# Altium schematic sheet peripheral_UART.SchDoc: UART Module
size A3; Author: mayerph; DrawnBy: mayerph; Organization: IIS; Revision: PA; SheetNumber: 3; SheetTotal: 3
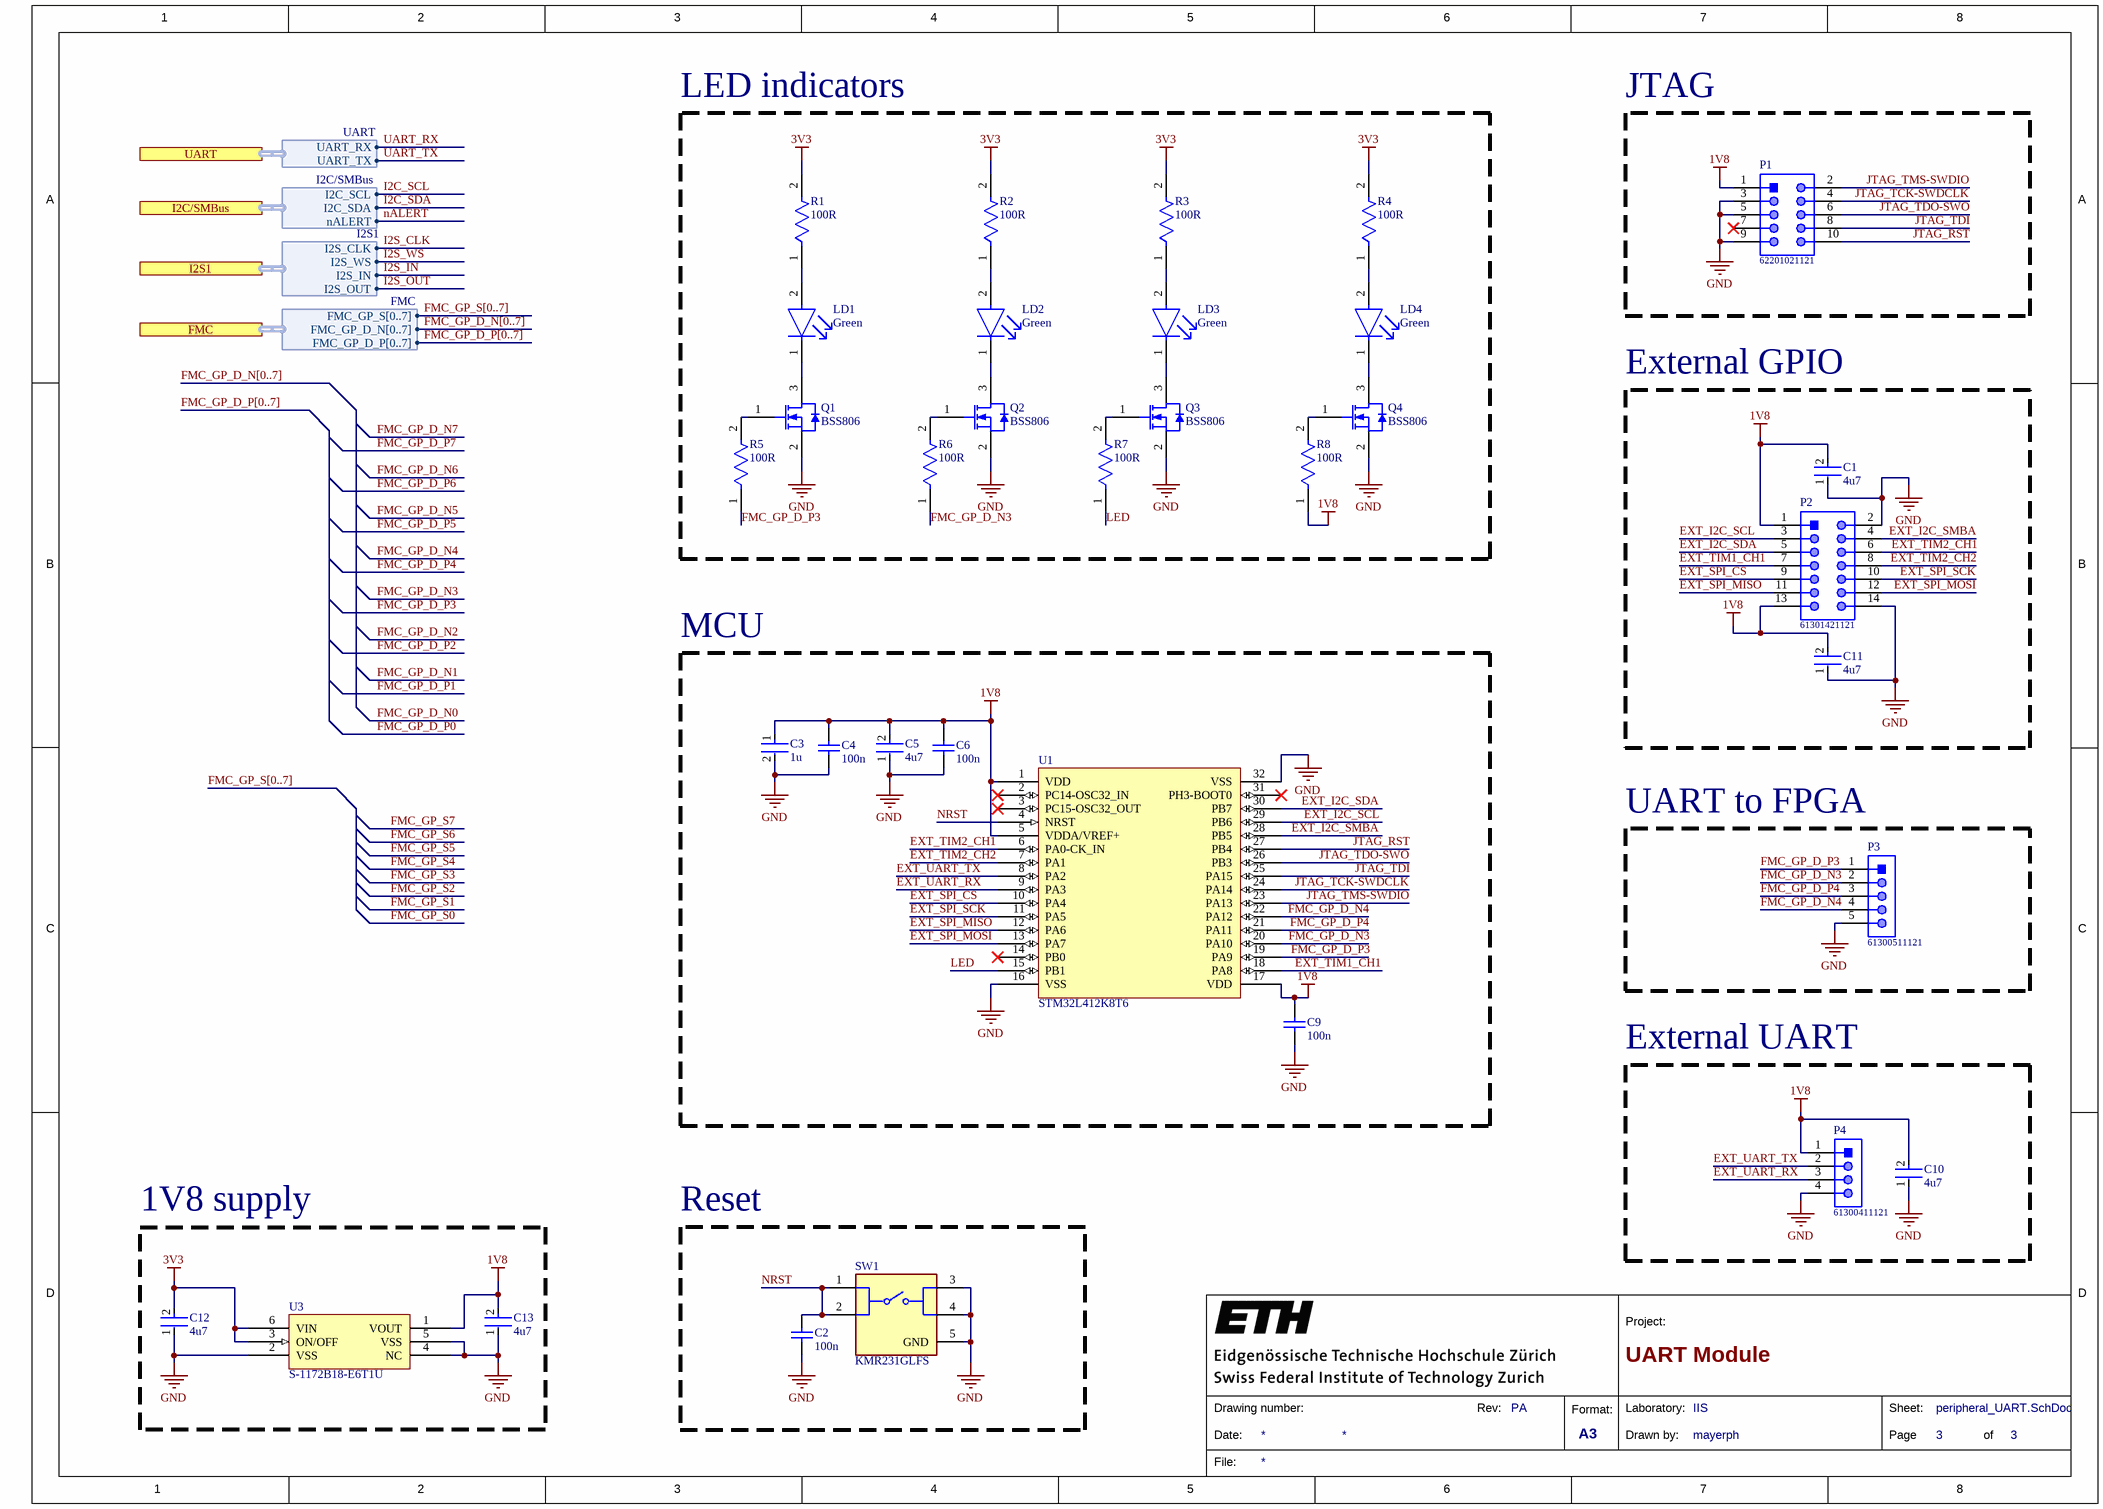
[diagram p0: peripheral_UART.SchDoc]

## Parts
C1  4u7  [FP-C1608-080-0_1-IPC_C]
C2  100n  [CAPC1608X90X35ML15T15]
C3  1u  [FP-CL10B105KO8NNNC-MFG]
C4  100n  [CAPC1608X90X35ML15T15]
C5  4u7  [FP-C1608-080-0_1-IPC_C]
C6  100n  [CAPC1608X90X35ML15T15]
C9  100n  [CAPC1608X90X35ML15T15]
C10  4u7  [FP-C1608-080-0_1-IPC_C]
C11  4u7  [FP-C1608-080-0_1-IPC_C]
C12  4u7  [FP-C1608-080-0_1-IPC_C]
C13  4u7  [FP-C1608-080-0_1-IPC_C]
LD1  Green  [FP-150060VS75000-MFG]
LD2  Green  [FP-150060VS75000-MFG]
LD3  Green  [FP-150060VS75000-MFG]
LD4  Green  [FP-150060VS75000-MFG]
P1  62201021121  [62201021121]
P2  61301421121  [61301421121]
P3  61300511121  [61300511121]
P4  61300411121  [61300411121]
Q1  BSS806  [FAIR-SSOT3L-3_V]
Q2  BSS806  [FAIR-SSOT3L-3_V]
Q3  BSS806  [FAIR-SSOT3L-3_V]
Q4  BSS806  [FAIR-SSOT3L-3_V]
R1  100R  [FP-CRCW0603-e3-IPC_B]
R2  100R  [FP-CRCW0603-e3-IPC_B]
R3  100R  [FP-CRCW0603-e3-IPC_B]
R4  100R  [FP-CRCW0603-e3-IPC_B]
R5  100R  [FP-CRCW0603-e3-IPC_B]
R6  100R  [FP-CRCW0603-e3-IPC_B]
R7  100R  [FP-CRCW0603-e3-IPC_B]
R8  100R  [FP-CRCW0603-e3-IPC_B]
SW1  KMR231GLFS  [FP-KMR231GLFS-MFG]
U1  STM32L412K8T6  [STM32L412K8T6]
U3  S-1172B18-E6T1U  [S1172]

## Blocks framed on the sheet
LED indicators: LD1-LD4 Q1-Q4 R1-R8
JTAG: P1
External GPIO: C1 C11 P2
MCU: C3-C6 C9 U1
UART to FPGA: P3
External UART: C10 P4
1V8 supply: C12 C13 U3
Reset: C2 SW1

## Ports
FMC (harness FMC), I2C/SMBus (harness I2C/SMBus), I2S1 (harness I2S1), UART (harness UART)

## Harnesses
I2C/SMBus: I2C_SDA, I2C_SCL, nALERT
UART: UART_TX, UART_RX
I2S1: I2S_OUT, I2S_IN, I2S_WS, I2S_CLK
FMC: FMC_GP_D_N[0..7], FMC_GP_S[0..7], FMC_GP_D_P[0..7]

## Nets
1V8: C1.2 C3.1 C4.2 C5.2 C6.2 C9.2 C10.2 C11.2 C13.2 P1.1 P2.1 P2.13 P4.1 R8.1 U1.1(VDD) U1.5(VDDA/VREF+) U1.17(VDD) U3.1(VOUT)
3V3: C12.2 R1.2 R2.2 R3.2 R4.2 U3.3(ON/OFF) U3.6(VIN)
GND: C1.1 C2.1 C3.2 C4.1 C5.1 C6.1 C9.1 C10.1 C11.1 C12.1 C13.1 P1.3 P1.5 P1.9 P2.2 P2.14 P3.5 P4.4 Q1.2(S) Q2.2(S) Q3.2(S) Q4.2(S) SW1.3 SW1.4 SW1.5(GND) U1.16(VSS) U1.32(VSS) U3.2(VSS) U3.4(NC) U3.5(VSS)
EXT_I2C_SCL: P2.3 U1.29(PB6)
EXT_I2C_SDA: P2.5 U1.30(PB7)
EXT_I2C_SMBA: P2.4 U1.28(PB5)
EXT_SPI_CS: P2.9 U1.10(PA4)
EXT_SPI_MISO: P2.11 U1.12(PA6)
EXT_SPI_MOSI: P2.12 U1.13(PA7)
EXT_SPI_SCK: P2.10 U1.11(PA5)
EXT_TIM1_CH1: P2.7 U1.18(PA8)
EXT_TIM2_CH1: P2.6 U1.6(PA0-CK_IN)
EXT_TIM2_CH2: P2.8 U1.7(PA1)
EXT_UART_RX: P4.3 U1.9(PA3)
EXT_UART_TX: P4.2 U1.8(PA2)
FMC_GP_D_N3: P3.2 R6.1 U1.20(PA10)
FMC_GP_D_N4: P3.4 U1.22(PA12)
FMC_GP_D_P3: P3.1 R5.1 U1.19(PA9)
FMC_GP_D_P4: P3.3 U1.21(PA11)
I2C_SCL: port I2C/SMBus.I2C_SCL
I2C_SDA: port I2C/SMBus.I2C_SDA
I2S_CLK: port I2S1.I2S_CLK
I2S_IN: port I2S1.I2S_IN
I2S_OUT: port I2S1.I2S_OUT
I2S_WS: port I2S1.I2S_WS
JTAG_RST: P1.10 U1.27(PB4)
JTAG_TCK-SWDCLK: P1.4 U1.24(PA14)
JTAG_TDI: P1.8 U1.25(PA15)
JTAG_TDO-SWO: P1.6 U1.26(PB3)
JTAG_TMS-SWDIO: P1.2 U1.23(PA13)
LED: R7.1 U1.15(PB1)
nALERT: port I2C/SMBus.nALERT
NRST: C2.2 SW1.1 SW1.2 U1.4(NRST)
UART_RX: port UART.UART_RX
UART_TX: port UART.UART_TX
NetLD1_1: LD1.1(C) Q1.3(D)
NetLD1_2: LD1.2(A) R1.1
NetLD2_1: LD2.1(C) Q2.3(D)
NetLD2_2: LD2.2(A) R2.1
NetLD3_1: LD3.1(C) Q3.3(D)
NetLD3_2: LD3.2(A) R3.1
NetLD4_1: LD4.1(C) Q4.3(D)
NetLD4_2: LD4.2(A) R4.1
NetQ1_1: Q1.1(G) R5.2
NetQ2_1: Q2.1(G) R6.2
NetQ3_1: Q3.1(G) R7.2
NetQ4_1: Q4.1(G) R8.2

Not connected (* = marked no-connect by the designer): P1 7*; U1 2(PC14-OSC32_IN)* 3(PC15-OSC32_OUT)* 14(PB0)* 31(PH3-BOOT0)*

## Buses and harness runs
bus FMC_GP_D_N[0..7]
bus FMC_GP_D_P[0..7]
bus FMC_GP_S[0..7]

## Notes on the sheet
- 1
- 2
- 3
- 4
- 5
- 6
- 7
- 8
- A
- B
- C
- D
- Project:
- Date:
- Drawing number:
- Rev:
- Format:
- A3
- Drawn by:
- Laboratory:
- Page
- Sheet:
- of
- File:

## Library data of the parts
C1 C5 C10-C13 = CMP-2000-04981-2: Multilayer Ceramic Capacitors 4.7μF ±10% 16V X7R SMD 0603; Manufacturer: Murata Electronics; Dielectric: X5R; P\N: GRM188Z71C475KE21D; Tolerance: 10%; Thickness: 0.035inch; Length: 1.6mm; Width: 0.031inch; Height: 0.8mm; Package Quantity: 1; Voltage: 16V; Construction: Flat; Weight: 7.1E-05oz; Depth: 0.8mm; Case Code (Metric): 1608; Series: C; Lead Free: Lead Free; Voltage Rating: 16V; Voltage Rating (DC): 16V; Value: 4u7; Termination: SMD/SMT; REACH SVHC: No SVHC; RoHS Compliant: Yes; Case Code (Imperial): 0603; Case/Package: 0603; Mount: Surface Mount; Dielectric Material: Ceramic; Packaging: Tape and Reel; Min Operating Temperature: -55°C; Max Operating Temperature: 85°C; Supplier: Digi-Key; Supplier P/N: 490-GRM188Z71C475KE21DCT-ND
C2 C4 C6 C9 = CMP-2006-04496-1: Multilayer Ceramic Capacitors 100nF ±10% 16V X7R SMD 0603; Manufacturer: KEMET; Part Number: 0603YC104KAZ2A; P\N: C0603C104K4RAC7867; Value: 100n; Supplier: Digi-Key; Supplier P/N: 399-C0603C104K4RAC7867CT-ND
C3 = CMP-2000-06093-2: Multilayer Ceramic Capacitors 1μF ±10% 16V X7R SMD 0603; Manufacturer: KEMET; Manufacturer Part Number: CL10B105KO8NNNC; Capacitance: 1uF; Temperature Coefficient: 15%; P\N: C0603C105K4RAC7411; Voltage Rating: 16V; Automotive: No; ComponentLink2Description: Datasheet; Device Class L3: Ceramic Capacitors; Temperature Characteristic: X7R; Temperature Range High: +125°C; Digikey Description: CAP CER 1UF 16V X7R 0603; Device Class L2: Capacitors; Octopart: https://octopart.com/cl10b105ko8nnnc-samsung-19018973; ComponentLink2URL: http://www.samsungsem.com/global/front/downloadcms.do?path=%2F%2Fglobal%2F%2Fsupport%2F%2Fproduct-search%2F%2Fmlcc%2F%2F__icsFiles%2F%2Fafieldfile%2F%2F2019%2F%2F06%2F%2F18&fileName=CL10B105KO8NNNC-19.pdf; Lead Free: Yes; Height: 0.9mm; Package: CL10B105KO8NNNC; Temperature Range Low: -55°C; Value: 1u; Material: Ceramic; Device Class L1: Passive Components; RoHS: TRUE; Temperature: -55°C to +125°C; Category: Cap; Ipc Land Pattern Name: CAPC16080X80; Tolerance: 10%; Supplier: Digi-Key; Supplier P/N: 399-C0603C105K4RAC7411CT-ND
LD1-LD4 = CMP-1426-00006-5: LED GREEN CLEAR 0603 SMD; Manufacturer: Wurth Elektronik; Viewing Angle: 140°; Reverse Voltage (DC): 5V; Forward Voltage: 2V; Power Rating: 72mW; Lens Size: 0.7mm; Test Current: 20mA; Lens Color: Colorless; Lens Style: Rectangular; Luminous Intensity: 40mcd; Wavelength: 570nm; P\N: 150060VS75003; Length: 1.6mm; Max Operating Temperature: 85°C; Lens Transparency: Clear; Width: 0.8mm; Mount: Surface Mount; Weight: 0.000882oz; Package Quantity: 4000; Packaging: Cut Tape; RoHS Compliant: Yes; Case/Package: 0603; Series: WL-SMCW; Case Code (Metric): 1608; Illumination Color: Green; Color: Green; Case Code (Imperial): 0603; Forward Current: 20mA; Min Operating Temperature: -40°C; Height: 0.8mm; Dominant Wavelength: 570nm; Number of Pins: 2; Value: Green; Supplier: Digi-Key; Supplier P/N: 732-150060VS75003CT-ND
P1 = CMP-1502-00948-1: THT Vertical Pin Header WR-PHD, Pitch 1.27 mm, Dual Row, 10 pins; Manufacturer: Wurth Elektronik; Rated Current: 1A; Pin Number: 10; Working Voltage: 100VAC; Contact Resistance: 20mOhm; Withstanding Voltage: 500VAC; Pitch: 1.27mm; Gender: Male; Mounting Technology: THT; Manufacturer URL: http://www.we-online.de; Package Reference: 62201021121; Row Number: Dual; Datasheet URL: https://katalog.we-online.de/em/datasheet/62201021121.pdf; Publisher: WurthElektronik; Packaging: Box; Operating Temperature: -40to105degC; Orientation: Vertical; Part Number: 62201021121; P\N: 62201021121; Supplier: Digi-Key; Supplier P/N: 732-5374-ND
P2 = CMP-1502-01093-1: THT Vertical Pin Header WR-PHD, Pitch 2.54 mm, Dual Row, 14 pins; Manufacturer: Wurth Elektronik; Rated Current: 3A; Withstanding Voltage: 500VAC; Gender: Male; Pin Number: 14; Pitch: 2.54mm; Working Voltage: 250VAC; Contact Resistance: 20mOhm; Mounting Technology: THT; Orientation: Vertical; Packaging: Bag; Part Number: 61301421121; Manufacturer URL: http://www.we-online.de; Datasheet URL: https://katalog.we-online.de/em/datasheet/6130xx21121.pdf; Operating Temperature: -40to105degC; Package Reference: 61301421121; Publisher: WurthElektronik; Row Number: Dual; P\N: 61301421121; Supplier: Digi-Key; Supplier P/N: 732-5298-ND
P3 = CMP-1502-01068-1: THT Vertical Pin Header WR-PHD, Pitch 2.54 mm, Single Row, 5 pins; Manufacturer: Wurth Elektronik; Pin Number: 5; Contact Resistance: 20mOhm; Working Voltage: 250VAC; Pitch: 2.54mm; Withstanding Voltage: 500VAC; Rated Current: 3A; Gender: Male; Datasheet URL: https://katalog.we-online.de/em/datasheet/6130xx11121.pdf; Orientation: Vertical; Mounting Technology: THT; Row Number: Single; Package Reference: 61300511121; Publisher: WurthElektronik; Part Number: 61300511121; Packaging: Bag; Manufacturer URL: http://www.we-online.de; Operating Temperature: -40to105degC; P\N: 61300511121; Supplier: Digi-Key; Supplier P/N: 732-5318-ND
P4 = CMP-1502-01064-1: THT Vertical Pin Header WR-PHD, Pitch 2.54 mm, Single Row, 4 pins; Manufacturer: Wurth Elektronik; Withstanding Voltage: 500VAC; Rated Current: 3A; Working Voltage: 250VAC; Pin Number: 4; Gender: Male; Contact Resistance: 20mOhm; Pitch: 2.54mm; Manufacturer URL: http://www.we-online.de; Operating Temperature: -40to105degC; Packaging: Bag; Mounting Technology: THT; Package Reference: 61300411121; Datasheet URL: https://katalog.we-online.de/em/datasheet/6130xx11121.pdf; Publisher: WurthElektronik; Part Number: 61300411121; Row Number: Single; Orientation: Vertical; P\N: 61300411121; Supplier: Digi-Key; Supplier P/N: 732-5317-ND
Q1-Q4 = CMP-2000-06249-1: MOSFET N-CH 20V 2.3A SOT23-3; Manufacturer: Infineon Technologies; RDS-on: 0.07@4.5VOhm; Typical Fall Time: 3ns; Rad Hard: No; Channel Mode: Enhancement; Package Version: Rev. 3, 05/2015; Maximum Gate Source Voltage: ±8V; Typical Rise Time: 8.5ns; Typical Turn-Off Delay Time: 11ns; Maximum Continuous Drain Current: 1.7A; Channel Type: N; Typical Turn-On Delay Time: 5ns; P\N: BSS806NEH6327XTSA1; Packaging: Tape&Reel; Mounting Technology: SurfaceMount; Maximum Drain Source Voltage: 20V; Mounting: SurfaceMount; Manufacturer URL: https://www.fairchildsemi.com/; Datasheet URL: https://www.fairchildsemi.com/datasheets/FD/FDN335N.pdf; Package Description: 3-Pin Small Outline Transistor, Body 2.92 x 1.4 mm, Pitch 0.95 mm; Package URL: https://www.fairchildsemi.com/package-drawings/MA/MA03B.pdf; Datasheet Version: Rev. C, 04/1999; Package Reference: SSOT3L; Package: 3SuperSOT; Operating Temperature: -55to150°C; Category: MOSFET; Value: BSS806; Supplier: Digi-Key; Supplier P/N: BSS806NEH6327XTSA1CT-ND
R1-R8 = CMP-2000-03827-2: RES Thick Film, 100Ω, 5%, 0.1W, 200ppm/°C, 0603; Manufacturer: Panasonic Electronic Components; Power Rating: 100mW; Voltage Rating: 75V; P\N: ERJ-3EKF1000V; Weight: 7.1E-05oz; Max Operating Temperature: 155°C; Military Standard: Not; Case Code (Imperial): 0603; Case/Package: 0603; Packaging: Tape and Reel; Number of Terminations: 2; Package Quantity: 1; Radiation Hardening: No; Termination: SMD/SMT; Case Code (Metric): 1608; Min Operating Temperature: -55°C; Value: 100R; Height: 0.02inch; Length: 1.55mm; Tolerance: 5%; Width: 0.85mm; Contact Plating: Tin; Max Power Dissipation: 100mW; Features: Automotive AEC-Q200; Composition: Thick Film; Temperature Coefficient: 200ppm/°C; Depth: 0.85mm; Supplier: Digi-Key; Supplier P/N: P100HCT-ND
SW1 = CMP-2000-06516-3: SWITCH TACTILE SPST-NO 0.05A 32V; Manufacturer: C&K; Switch Travel: 0.25mm; Current Rating: 50mA; Operating Force: 3N; Actuator Type: Standard; Illumination Type: Non-Illuminated; Mechanical Life: 150000Cycles; Insulation Resistance: 1GR; Contact Resistance: 100mR; Actuator Length: 0.5mm; Power Rating: 1W; Throw Configuration: SPST; Switch Function: Off-Mom; Min Operating Temperature: -40°C; Termination: Gull Wing; Orientation: Straight; Lead Free: Lead Free; Width: 2.8mm; Contact Material: Silver; Max Voltage Rating (DC): 32V; Max Current Rating: 50mA; Contact Plating: Silver; Radiation Hardening: No; Depth: 4.6mm; Mount: Surface Mount; Max Operating Temperature: 85°C; Case/Package: SMD/SMT; Contact Current Rating: 50mA; Length: 4.6mm; Package Quantity: 7000; Series: KMR2; REACH SVHC: No SVHC; Packaging: Cut Tape; Voltage Rating (DC): 32V; P\N: KMR231GLFS; Supplier: Digi-Key; Supplier P/N: 401-1429-1-ND
U1 = STM32L412K8T6: MCU 32-bit; Manufacturer: STMicroelectronics; P\N: STM32L412K8T6; Supplier: Digi-Key; Supplier P/N: 497-STM32L412K8T6-ND
U3 = S1172: LDO 1V8 fixed; Manufacturer: ABLIC Inc.; P\N: S-1172B18-E6T1U; Supplier: Digi-Key; Supplier P/N: 1662-1402-1-ND